# Altium schematic sheet Power Subsystem.SchDoc: Power Subsystem
size A4; DrawnBy: Amal Araweelo Almis; DocumentNumber: SCH-001; Revision: A; SheetNumber: 1; SheetTotal: 3
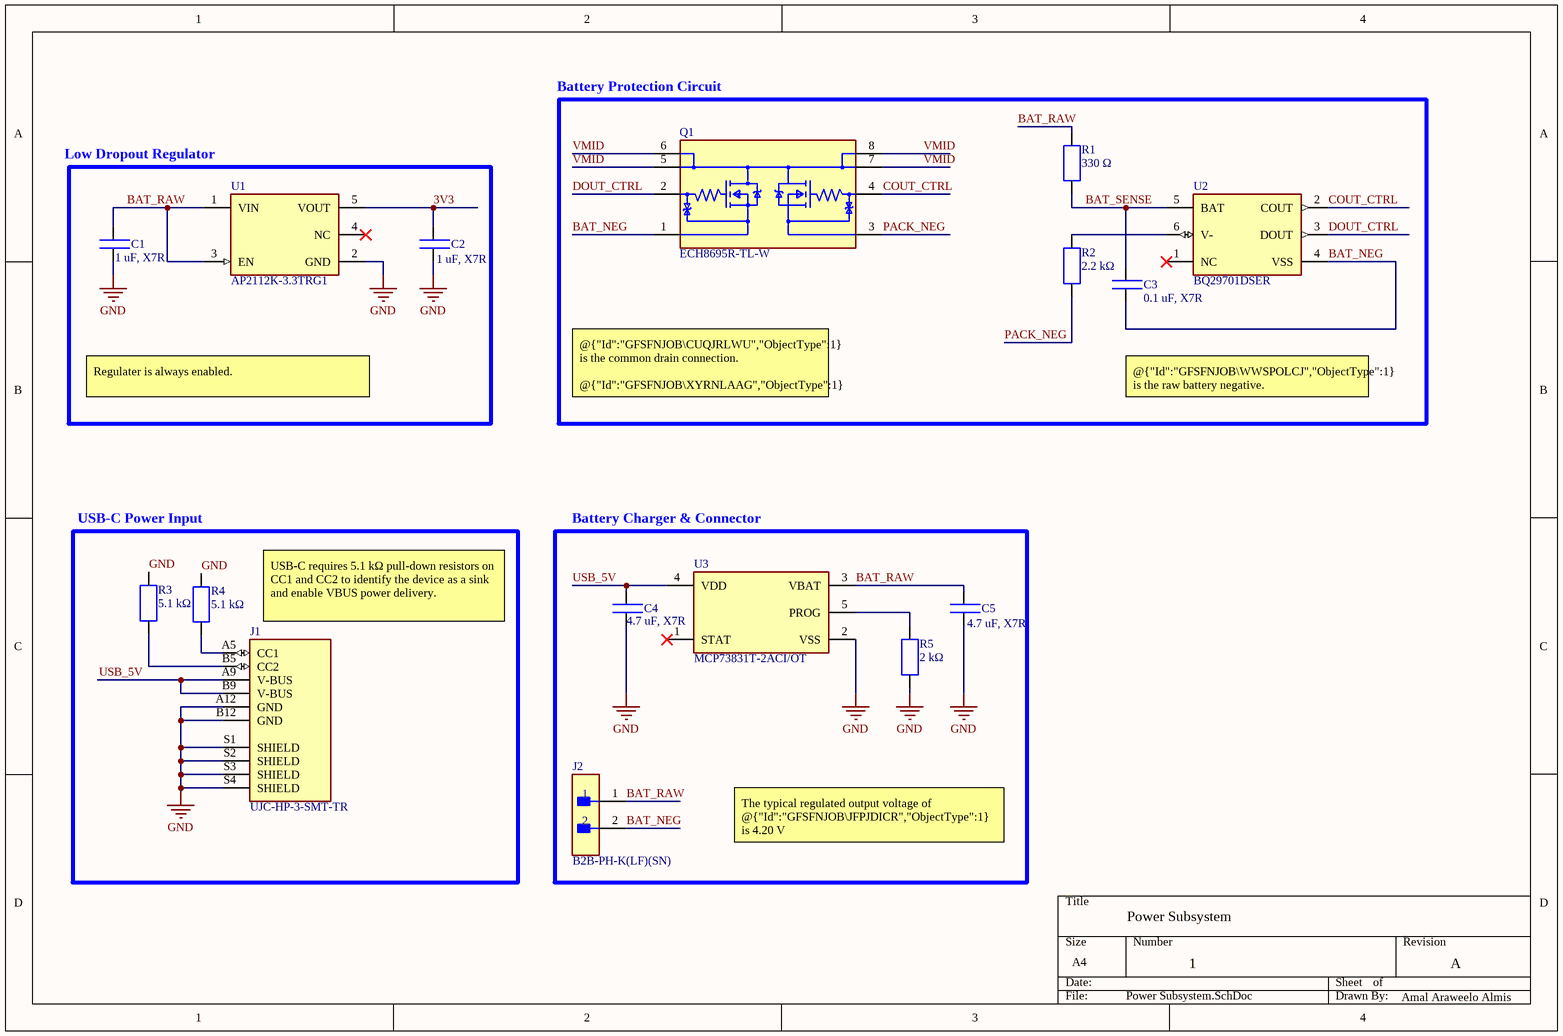
[diagram p0: Power Subsystem.SchDoc]

## Parts
C1  1 uF, X7R  [CAP_0402]
C2  1 uF, X7R  [CAP_0402]
C3  0.1 uF, X7R  [CAP_0402]
C4  4.7 uF, X7R  [CAP_0402]
C5  4.7 uF, X7R  [CAP_0402]
J1  UJC-HP-3-SMT-TR  [CUI_UJC-HP-3-SMT-TR]
J2  B2B-PH-K(LF)(SN)  [FP-B2B-PH-K_LF_SN-MFG]
Q1  ECH8695R-TL-W  [FP-318BF-MFG]
R1  330 Ω  [RES_0402]
R2  2.2 kΩ  [RES_0402]
R3  5.1 kΩ  [RES_0402]
R4  5.1 kΩ  [RES_0402]
R5  2 kΩ  [RES_0402]
U1  AP2112K-3.3TRG1  [FP-SOT25-IPC_C]
U2  BQ29701DSER  [FP-DSE0006A-IPC_A]
U3  MCP73831T-2ACI/OT  [FP-C04-091-OT-IPC_A]

## Blocks framed on the sheet
Battery Protection Circuit: C3 Q1 R1 R2 U2
Low Dropout Regulator: C1 C2 U1
USB-C Power Input: J1 R3 R4
Battery Charger & Connector: C4 C5 J2 R5 U3

## Nets
GND: C1.1 C2.1 C4.1 C5.1 J1.A12(GND) J1.B12(GND) J1.S1(SHIELD) J1.S2(SHIELD) J1.S3(SHIELD) J1.S4(SHIELD) R3.1 R4.2 R5.1 U1.2(GND) U3.2(VSS)
3V3: C2.2 U1.5(VOUT)
BAT_NEG: C3.1 J2.2 Q1.1(Source1) U2.4(VSS)
BAT_RAW: C1.2 C5.2 J2.1 R1.1 U1.1(VIN) U1.3(EN) U3.3(VBAT)
BAT_SENSE: C3.2 R1.2 U2.5(BAT)
COUT_CTRL: Q1.4(Gate2) U2.2(COUT)
DOUT_CTRL: Q1.2(Gate1) U2.3(DOUT)
PACK_NEG: Q1.3(Source2) R2.1
USB_5V: C4.2 J1.A9(V-BUS) J1.B9(V-BUS) U3.4(VDD)
VMID: Q1.5(Drain) Q1.6(Drain) Q1.7(Drain) Q1.8(Drain)
NetJ1_A5: J1.A5(CC1) R4.1
NetJ1_B5: J1.B5(CC2) R3.2
NetR2_2: R2.2 U2.6(V-)
NetR5_2: R5.2 U3.5(PROG)

Not connected (* = marked no-connect by the designer): U1 4(NC)*; U2 1(NC)*; U3 1(STAT)*

## Notes on the sheet
- Regulater is always enabled.
- @{"Id":"GFSFNJOB\CUQJRLWU","ObjectType":1} is the common drain connection.
  @{"Id":"GFSFNJOB\XYRNLAAG","ObjectType":1} is the protected battery negative and should connected to system @{"Id":"MAUZWXRV\VNFEDLCC","ObjectType":1}.
- @{"Id":"GFSFNJOB\WWSPOLCJ","ObjectType":1} is the raw battery negative.
- (near J1) USB-C requires 5.1 kΩ pull-down resistors on CC1 and CC2 to identify the device as a sink and enable VBUS power delivery.
- The typical regulated output voltage of @{"Id":"GFSFNJOB\JFPJDICR","ObjectType":1} is 4.20 V

## Library data of the parts
C1 = CAP_0402: Multilayer Ceramic Capacitors MLCC - SMD/SMT 6.3V 1uF X7R 0402 10% HI CV; Manufacturer 1: YAGEO; Manufacturer Part Number 1: CC0402KRX7R5BB105; Capacitance: 100 pF; Tolerance: 5%; LCSC Part Number: C106200; Supplier 1: Mouser; Supplier Part Number 1: 603-CC402KRX7R5BB105
C2 = CAP_0402: Multilayer Ceramic Capacitors MLCC - SMD/SMT 6.3V 1uF X7R 0402 10% HI CV; Manufacturer: YAGEO; Manufacturer Part Number: CC0402JRNPO9BN101; Capacitance: 100 pF; Tolerance: 5%; LCSC Part Number: C106200
C3 = CAP_0402: Multilayer Ceramic Capacitors MLCC - SMD/SMT 16 V 0.1uF X7R 0402 10%; Capacitance: 100 pF; Tolerance: 5%; Supplier 1: Mouser; Supplier Part Number 1: 603-CC402KRX7R7BB104; LCSC Part Number: C106200
C4 = CAP_0402: Multilayer Ceramic Capacitor MLCC; Manufacturer 1: YAGEO; Manufacturer Part Number 1: CC1206KFX7R9BB475; Capacitance: 100 pF; Tolerance: 5%; LCSC Part Number: C106200; Supplier 1: Mouser; Supplier Part Number 1: 603-CC1206KFX7R9B475
C5 = CAP_0402: Multilayer Ceramic Capacitor MLCC; Manufacturer: YAGEO; Manufacturer Part Number: CC0402JRNPO9BN101; Capacitance: 100 pF; Tolerance: 5%; LCSC Part Number: C106200
J1 = UJC-HP-3-SMT-TR: USB Connectors USB jack, C type, power only, 6 pin, horizonal, gold flash plating, surface mount, T&R; Manufacturer 1: Same Sky; Package: None; Price: None; Value: *; MP: UJC-HP-3-SMT-TR; Availability: Unavailable; Manufacturer Part Number 1: UJC-HP-3-SMT-TR; Supplier 1: Mouser; Supplier Part Number 1: 490-UJC-HP-3-SMT-TR
J2 = CMP-17439-000674-1: Connector Header Through Hole 2 position 0.079" (2.00mm); Manufacturer 1: JST Commercial; Manufacturer Part Number 1: B2B-PH-K-S(LF)(SN); Gender: Male; Pitch: 2mm; Voltage Rating: 100V; Current Rating: 2A; Number of Positions: 2; Insulation Resistance: 1GR; Contact Plating: Tin; Color: Beige; Min Operating Temperature: -25°C; Mount: Through Hole; Number of Rows: 1; Termination: Crimp; Max Operating Temperature: 85°C; Lead Free: Lead Free; Contact Material: Brass; Material: Polyamide; Supplier 1: Mouser; Supplier Part Number 1: 306-B2BPHKSLFSNPP
Q1 = CMP-00278-51167104-1: ECH8695R-TL-W Dual N-Channel Power MOSFET, 24V, 11 A, 9.1 mΩ; Manufacturer Lifecycle Status: ACTIVE; Manufacturer 1: onsemi; Turn-On Delay Time: 300ns; Max Junction Temperature (Tj): 150°C; Rds On Max: 9.1mΩ; Turn-Off Delay Time: 19.7µs; Gate to Source Voltage (Vgs): 12.5V; Drain to Source Resistance: 7mΩ; Rise Time: 320ns; Fall Time: 22.3µs; Power Dissipation: 1.5W; Continuous Drain Current (ID): 11A; Number of Channels: 2; Max Power Dissipation: 1.4W; Mount: Surface Mount; RoHS: Compliant; Number of Pins: 8; Drain to Source Breakdown Voltage: 24V; Min Operating Temperature: -55°C; Width: 2.3mm; Max Operating Temperature: 150°C; Lifecycle Status: Production; Height: 950µm; Contact Plating: Tin; Element Configuration: Dual; Lead Free: Lead Free; Length: 2.9mm; Case/Package: SMD/SMT; Schedule B: 8541290080, 8541290080|8541290080, 8541290080|8541290080|8541290080, 8541290080|8541290080|8541290080|8541290080; Drain to Source Voltage (Vdss): 24V; NexarPartId: 51167104; Manufacturer Part Number 1: ECH8695R-TL-W; Supplier 1: Mouser; Supplier Part Number 1: 863-ECH8695R-TL-W
R1-R5 = RES_0402: Resistor SMD 0402 Generic; Manufacturer: YAGEO; Manufacturer Part Number: RC0402FR07150KL; Tolerance: 1%; Resistance: 150 kOhm; LCSC Part Number: C93947
U1 = CMP-12756-000035-1: IC REG LINEAR 3.3V 600MA SOT25; Manufacturer 1: Diodes Incorporated; Number of Regulators: 1; Output Type: Fixed; Polarity: Positive; Min Input Voltage: 2.5V; Max Input Voltage: 6V; Accuracy: 1.5%; Quiescent Current: 55uA; Dropout Voltage: 250mV; Min Operating Temperature: -40°C; Length: 3.1mm; Output Current: 600mA; Max Operating Temperature: 85°C; Package Quantity: 1; Output Voltage: 3.3V; Width: 1.7mm; Number of Outputs: 1; Packaging: Tape and Reel; Height: 1.3mm; Lead Free: Lead Free; Max Output Current: 600mA; Case/Package: SOT-23-5; Mount: Surface Mount; Number of Pins: 5; Manufacturer Part Number 1: AP2112K-3.3TRG1; Supplier 1: Mouser; Supplier Part Number 1: 621-AP2112K-3.3TRG1; Supplier Unit Price 1: 3.66
U2 = CMP-04911-000034-1: IC LITHIUM BATT PROTECT 6-SON; Manufacturer 1: Texas Instruments; Fault Protection: Over Current; Number of Cells: 1; Operating Supply Voltage: 28V; Number of Pins: 6; RoHS Compliant: Yes; Lead Free: Lead Free; Max Operating Temperature: 85°C; Case/Package: WFDFN; Contact Plating: Gold; Packaging: Tape and Reel; Mount: Surface Mount; Min Operating Temperature: -40°C; Manufacturer Part Number 1: BQ29701DSER; Supplier 1: Mouser; Supplier Part Number 1: 595-BQ29701DSER
U3 = CMP-0133-00143-2: IC CONTROLLR LI-ION 4.2V SOT23-5; Manufacturer 1: Microchip Technology; Max Power Dissipation: 1.54W; Output Current: 500mA; Max Output Voltage: 4.5V; Number of Outputs: 1; Min Output Voltage: 4.168V; Min Supply Voltage: 3.75V; Max Input Voltage: 6V; Voltage Rating: 4.534V; Drain to Source Resistance: 350mR; Max Operating Temperature: 85°C; Length: 0.122inch; Number of Pins: 5; REACH SVHC: No SVHC; Radiation Hardening: No; Min Operating Temperature: -40°C; Weight: 0.00709oz; Contact Plating: Tin; Termination: SMD/SMT; Case/Package: SOT-23; Mount: Surface Mount; Width: 0.071inch; Packaging: Tape and Reel; Number of Cells: 1; Max Charge Current: 500mA; Height: 0.051inch; Number of Channels: 1; Output Voltage: 4.2V; Max Supply Voltage: 6V; Lead Free: Lead Free; Manufacturer Part Number 1: MCP73831T-2ACI/OT; Supplier 1: Mouser; Supplier Part Number 1: 579-MCP73831T-2ACIOT